# EasyEDA schematic SCH_NRF_Rapid_Test_Board_2021-07-05.json
TITLE: Sheet_1; REV: 1.0; Date: 2021-06-20; Sheet: 1/1; Drawn By: Sadat Rafi; Company: Your Company
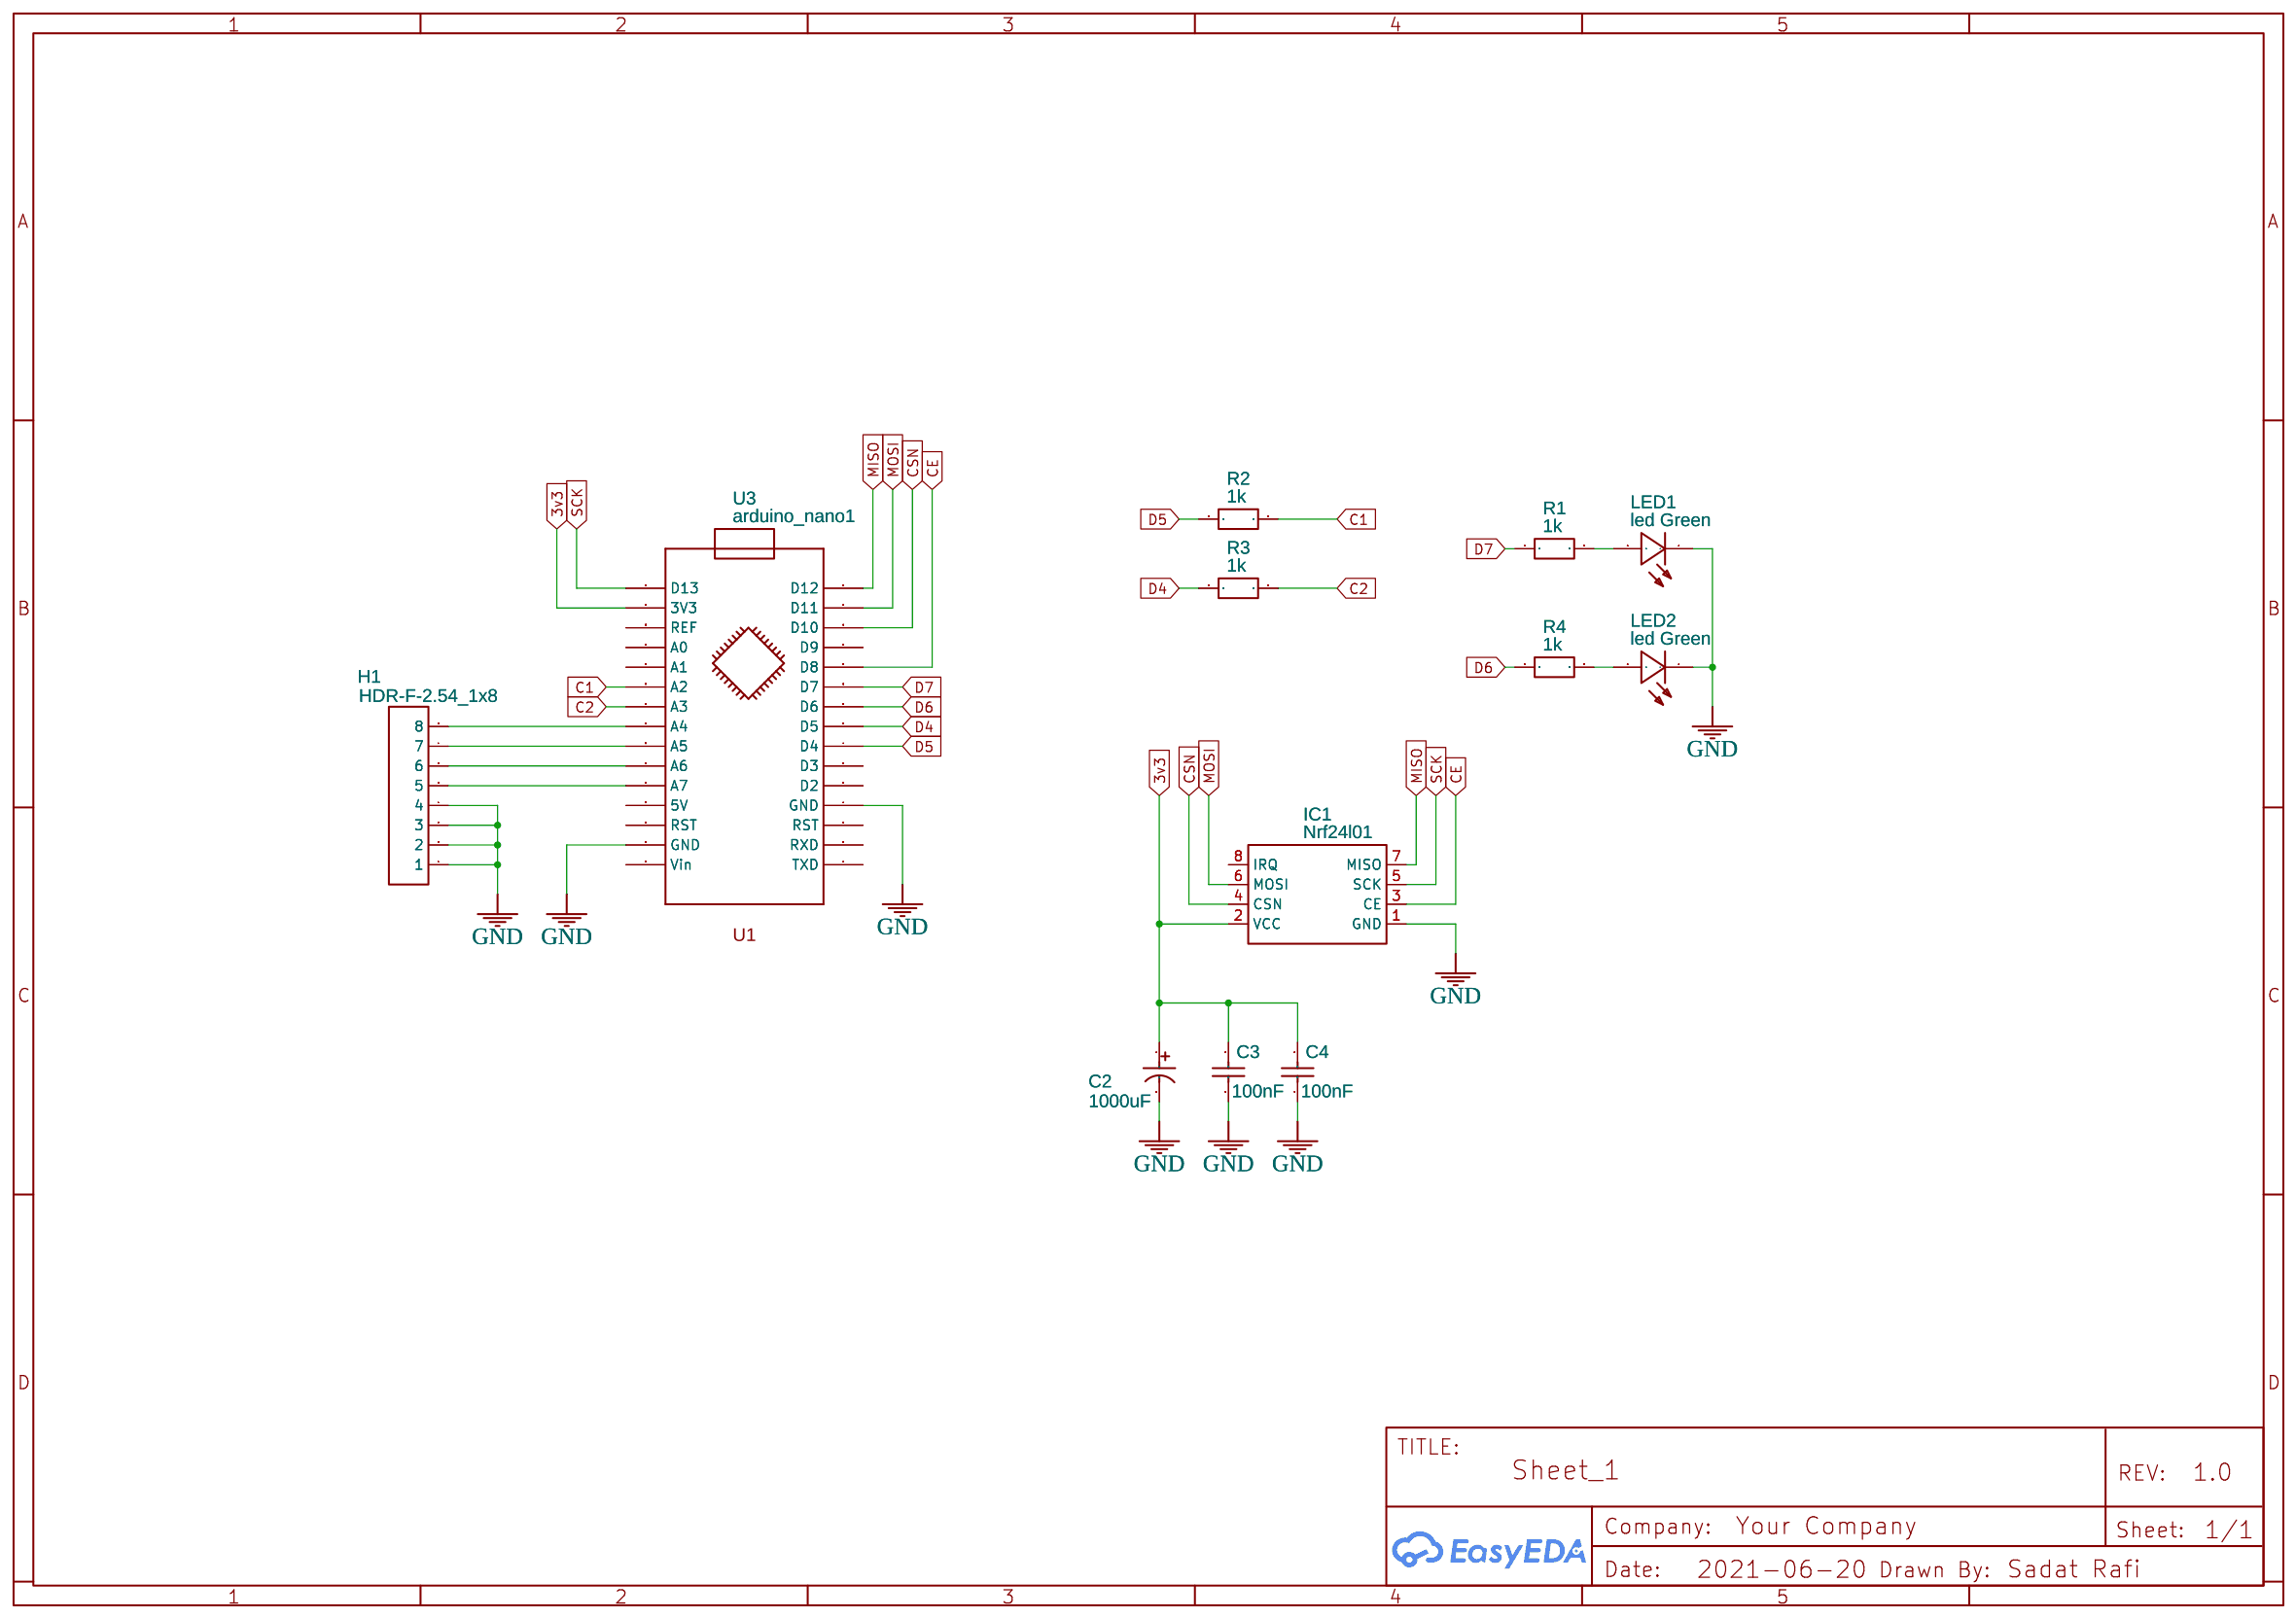
[diagram p0: schematic sheet]

## Parts
C2  1000uF  [CAP-TH_BD10.0-P5.00-D1.0-FD]
C3  100nF  [C1206]
C4  100nF  [C1206]
H1  HDR-F-2.54_1x8  [HDR-F-2.54_1X8]
IC1  Nrf24l01  [NRF24L01_PA_EXT]
LED1  led Green  [LED1206-RD]
LED2  led Green  [LED1206-RD]
R1  1k  [R1206]
R2  1k  [R1206]
R3  1k  [R1206]
R4  1k  [R1206]
U3  arduino_nano1  [ARDUINO_NANO1]

## Library data of the parts
C2 = 1000uF 16V: Supplier: LCSC; Manufacturer: ValuePro; Supplier Part: C43909; JLCPCB Part Class: Extended Part
C3 C4 = CL31B104KBCNNNC: Supplier: LCSC; Manufacturer: SAMSUNG; Supplier Part: C24497; JLCPCB Part Class: Basic Part
H1 = HDR-F-2.54_1x8: Supplier Part: C225505; Supplier: LCSC; Contributor: LCEDA_Lib
IC1 = Nrf24l01: Manufacturer Part: NRF24L01; Supplier: emiliopisa; Supplier Part: 01; Contributor: emiliopisa
LED1 LED2 = led Green: Supplier: LCSC; Manufacturer: KENTO; Supplier Part: C14641; JLCPCB Part Class: Extended Part
R1-R4 = R_1206_EU: Contributor: LCEDA_Lib
U3 = arduino_nano1: Contributor: Валентин Мандругин; Supplier: Arduino

## Nets
3v3: C2.1 C3.2 C4.2 IC1.2(VCC) U3.17(3V3)
GND: C2.2 C3.1 C4.1 H1.1 H1.2 H1.3 H1.4 IC1.1(GND) LED1.1(-) LED2.1(-) U3.4(GND) U3.29(GND)
C1: R2.2 U3.21(A2)
C2: R3.2 U3.22(A3)
CE: IC1.3(CE) U3.11(D8)
CSN: IC1.4(CSN) U3.13(D10)
D4: R3.1 U3.8(D5)
D5: R2.1 U3.7(D4)
D6: R4.1 U3.9(D6)
D7: R1.1 U3.10(D7)
MISO: IC1.7(MISO) U3.15(D12)
MOSI: IC1.6(MOSI) U3.14(D11)
SCK: IC1.5(SCK) U3.16(D13)
Net-(H1-5): H1.5 U3.26(A7)
Net-(H1-6): H1.6 U3.25(A6)
Net-(H1-7): H1.7 U3.24(A5)
Net-(H1-8): H1.8 U3.23(A4)
Net-(LED1-2): LED1.2(+) R1.2
Net-(LED2-2): LED2.2(+) R4.2

Not connected (* = marked no-connect by the designer): IC1 8(IRQ); U3 1(TXD) 2(RXD) 3(RST) 5(D2) 6(D3) 12(D9) 18(REF) 19(A0) 20(A1) 27(5V) 28(RST) 30(Vin)
